# EAGLE schematic board (EAGLE 9.6.2)

## Sheet 1 of 2
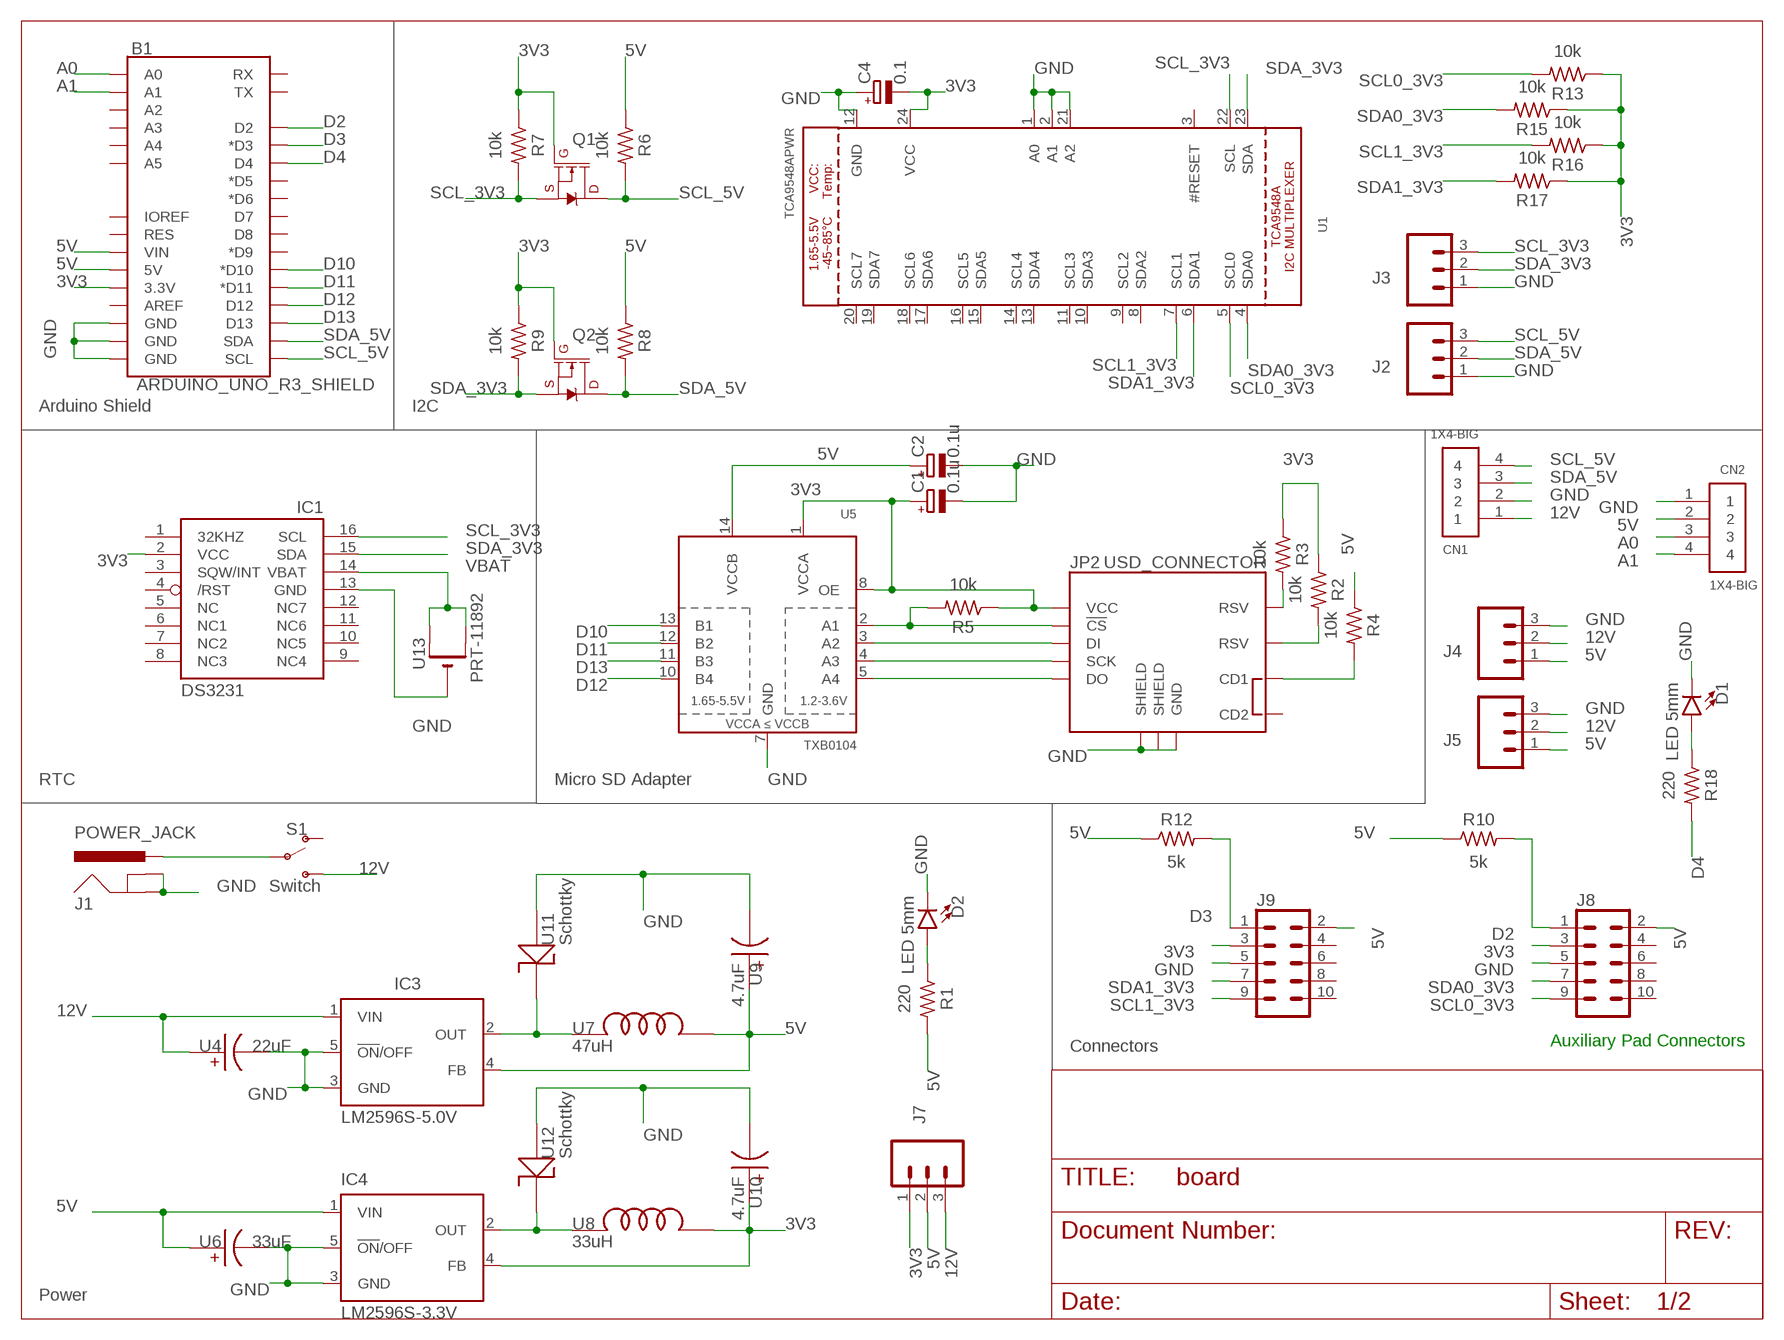
[diagram p0: schematic, sheet 1]

### Parts
B1  ARDUINO_UNO_R3_SHIELD  ARDUINO_UNO_R3_SHIELDUNO_R3_SHIELD_NOLABELS_LOCK  [UNO_R3_SHIELD_NOLABELS_LOCK]
C1  0.1u  C-POL_TANTALUM-1206(3216-METRIC)  [CAPMP3216X180N]
C2  0.1u  C-POL_TANTALUM-1206(3216-METRIC)  [CAPMP3216X180N]
C4  0.1  C-POL_TANTALUM-1206(3216-METRIC)  [CAPMP3216X180N]
CN1  1X4-BIG  [1X04-BIG]
CN2  1X4-BIG  [1X04-BIG]
D1  LED 5mm  LED5MM  [LED_5MM]
D2  LED 5mm  LED5MM  [LED_5MM]
IC1  DS3231/SO  [SO16W]
IC3  LM2596S-5.0V  LM2596S  [TO263-5]
IC4  LM2596S-3.3V  LM2596S  [TO263-5]
J1  POWER_JACK  [POWER_JACK_PTH]
J2  3-Pin Screw Terminal 5mm  CONN_03-SCREW-5MM  [SCREWTERMINAL-5MM-3]
J3  3-Pin Screw Terminal 5mm  CONN_03-SCREW-5MM  [SCREWTERMINAL-5MM-3]
J4  3-Pin Screw Terminal 5mm  CONN_03-SCREW-5MM  [SCREWTERMINAL-5MM-3]
J5  3-Pin Screw Terminal 5mm  CONN_03-SCREW-5MM  [SCREWTERMINAL-5MM-3]
J7  3-Pin Screw Terminal 5mm  CONN_03-SCREW-5MM  [SCREWTERMINAL-5MM-3]
J8  2x6 0.1" Shrouded Female Header  CONN_05X2SHD_LOCK  [2X5-SHROUDED_LOCK]
J9  2x6 0.1" Shrouded Female Header  CONN_05X2SHD_LOCK  [2X5-SHROUDED_LOCK]
JP2  USD_CONNECTOR  [MICRO-SD-SOCKET-PP]
Q1  220mA/50V/3.5Ω  MOSFET-NCH-BSS138  [SOT23-3]
Q2  220mA/50V/3.5Ω  MOSFET-NCH-BSS138  [SOT23-3]
R1  220  R-US_CHIP-0603(1608-METRIC)  [RESC1608X60]
R2  10k  R-US_CHIP-0603(1608-METRIC)  [RESC1608X60]
R3  10k  R-US_CHIP-0603(1608-METRIC)  [RESC1608X60]
R4  10k  R-US_CHIP-0603(1608-METRIC)  [RESC1608X60]
R5  10k  R-US_CHIP-0603(1608-METRIC)  [RESC1608X60]
R6  10k  R-US_CHIP-0603(1608-METRIC)  [RESC1608X60]
R7  10k  R-US_CHIP-0603(1608-METRIC)  [RESC1608X60]
R8  10k  R-US_CHIP-0603(1608-METRIC)  [RESC1608X60]
R9  10k  R-US_CHIP-0603(1608-METRIC)  [RESC1608X60]
R10  5k  R-US_CHIP-0603(1608-METRIC)  [RESC1608X60]
R12  5k  R-US_CHIP-0603(1608-METRIC)  [RESC1608X60]
R13  10k  R-US_CHIP-0603(1608-METRIC)  [RESC1608X60]
R15  10k  R-US_CHIP-0603(1608-METRIC)  [RESC1608X60]
R16  10k  R-US_CHIP-0603(1608-METRIC)  [RESC1608X60]
R17  10k  R-US_CHIP-0603(1608-METRIC)  [RESC1608X60]
R18  220  R-US_CHIP-0603(1608-METRIC)  [RESC1608X60]
S1  Switch  SWITCH-SPDT-PTH-11.6X4.0MM  [SWITCH_SPDT_PTH_11.6X4.0MM]
U1  TCA9548APWR  TCA9548A  [TSSOP24]
U4  22uF  CAP_ALUM_22UF_20%_63V_SMD  [CAP_ALUM_22UF_20%_63V_SMD]
U5  TXB0104  TXB0104PWRSOIC14  [SO14]
U6  33uF  CAP_ALUM_33UF_20%_63V_SMD  [CAP_ALUM_33UF_20%_63V_SMD]
U7  47uH  FIXED_IND_47UH_3.8A_60_MOHM_SMD  [FIXED_IND_47UH_3.8A_60_MOHM_SMD]
U8  33uH  FIXED_IND_47UH_3.8A_60_MOHM_SMD  [FIXED_IND_47UH_3.8A_60_MOHM_SMD]
U9  4.7uF  CAP_ALUM_4.7_UF_20%_100V_SMD  [CAP_ALUM_4.7UF_20%_100V_SMD]
U10  4.7uF  CAP_ALUM_4.7_UF_20%_100V_SMD  [CAP_ALUM_4.7UF_20%_100V_SMD]
U11  Schottky  DIODE_SCHOTTKY_40V_3A_SMC  [DIODE_SCHOTTKY_40V_3A_SMC]
U12  Schottky  DIODE_SCHOTTKY_40V_3A_SMC  [DIODE_SCHOTTKY_40V_3A_SMC]
U13  PRT-11892  CR2032SMT  [CR2032-SMD]

### Nets
3V3 [power]: B1.3.3V C1.1(+) C4.2(-) IC1.2(VCC) IC4.4(FB) J7.1 J8.3 J9.3 JP2.VCC Q1.1(G) Q2.1(G) R2.1 R3.1 R5.1 R7.1 R9.1 R13.1 R15.1 R16.1 R17.1 U1.24(VCC) U5.1(VCCA) U5.8(OE) U8.P$2 U10.P$2
5V [power]: B1.5V B1.VIN C2.1(+) CN2.2 IC3.4(FB) IC4.1(VIN) J4.1 J5.1 J7.2 J8.2 J9.2 R1.2 R4.1 R6.1 R8.1 R10.1 R12.1 U5.14(VCCB) U6.P$2 U7.P$2 U9.P$2
12V [power]: CN1.1 IC3.1(VIN) J4.2 J5.2 J7.3 S1.3(S) U4.P$2
!CS_3V3: JP2.CS(!CS) R5.2 U5.2(A1)
A0: B1.A0 CN2.3
A1: B1.A1 CN2.4
CDSDSD: JP2.CD1 R4.2
D2: B1.D2 J8.1 R10.2
D3: B1.D3(*D3) J9.1 R12.2
D4: B1.D4 R18.2
D10: B1.D10(*D10) U5.13(B1)
D11: B1.D11(*D11) U5.12(B2)
D12: B1.D12 U5.10(B4)
D13: B1.D13 U5.11(B3)
DI_3V3: JP2.DI U5.3(A2)
DO_3V3: JP2.DO U5.5(A4)
GND [power]: B1.GND@0(GND) B1.GND@1(GND) B1.GND@2(GND) C1.2(-) C2.2(-) C4.1(+) CN1.2 CN2.1 D1.K(C) D2.K(C) IC1.13(GND) IC3.3(GND) IC3.5(!ON!/OFF) IC4.3(GND) IC4.5(!ON!/OFF) J1.GND J1.GNDBREAK J2.1 J3.1 J4.3 J5.3 J8.5 J9.5 JP2.GND JP2.GND1(SHIELD) JP2.GND3(SHIELD) U1.1(A0) U1.2(A1) U1.12(GND) U1.21(A2) U4.P$1 U5.7(GND) U6.P$1 U9.P$1 U10.P$1 U11.P$1 U12.P$1 U13.-
N$1: D1.A R18.1
N$2: JP2.RSV1(RSV) R3.2
N$3: JP2.RSV2(RSV) R2.2
N$5: D2.A R1.1
N$7: IC3.2(OUT) U7.P$1 U11.P$2
N$10: IC4.2(OUT) U8.P$1 U12.P$2
PWR_IN [power]: J1.PWR S1.2(P)
SCK_3V3: JP2.SCLK(SCK) U5.4(A3)
SCL0_3V3: J8.9 R13.2 U1.5(SCL0)
SCL1_3V3: J9.9 R16.2 U1.7(SCL1)
SCL_3V3: IC1.16(SCL) J3.3 Q1.2(S) R7.2 U1.22(SCL)
SCL_5V: B1.SCL CN1.4 J2.3 Q1.3(D) R6.2
SDA0_3V3: J8.7 R15.2 U1.4(SDA0)
SDA1_3V3: J9.7 R17.2 U1.6(SDA1)
SDA_3V3: IC1.15(SDA) J3.2 Q2.2(S) R9.2 U1.23(SDA)
SDA_5V: B1.SDA CN1.3 J2.2 Q2.3(D) R8.2
VBAT: IC1.14(VBAT) U13.+$1(+) U13.+$2(+1)
Unconnected: B1.A2 B1.A3 B1.A4 B1.A5 B1.AREF B1.D5(*D5) B1.D6(*D6) B1.D7 B1.D8 B1.D9(*D9) B1.IOREF B1.RES B1.RX B1.TX IC1.1(32KHZ) IC1.3(SQW/INT) IC1.4(/RST) IC1.5(NC) IC1.6(NC1) IC1.7(NC2) IC1.8(NC3) IC1.9(NC4) IC1.10(NC5) IC1.11(NC6) IC1.12(NC7) J8.4 J8.6 J8.8 J8.10 J9.4 J9.6 J9.8 J9.10 JP2.CD2 S1.1(O) U1.3(#RESET) U1.8(SDA2) U1.9(SCL2) U1.10(SDA3) U1.11(SCL3) U1.13(SDA4) U1.14(SCL4) U1.15(SDA5) U1.16(SCL5) U1.17(SDA6) U1.18(SCL6) U1.19(SDA7) U1.20(SCL7)

### Notes on the sheet
- Arduino Shield | I2C
- RTC | Micro SD Adapter
- Auxiliary Pad Connectors
- Connectors
- Power

## Sheet 2 of 2
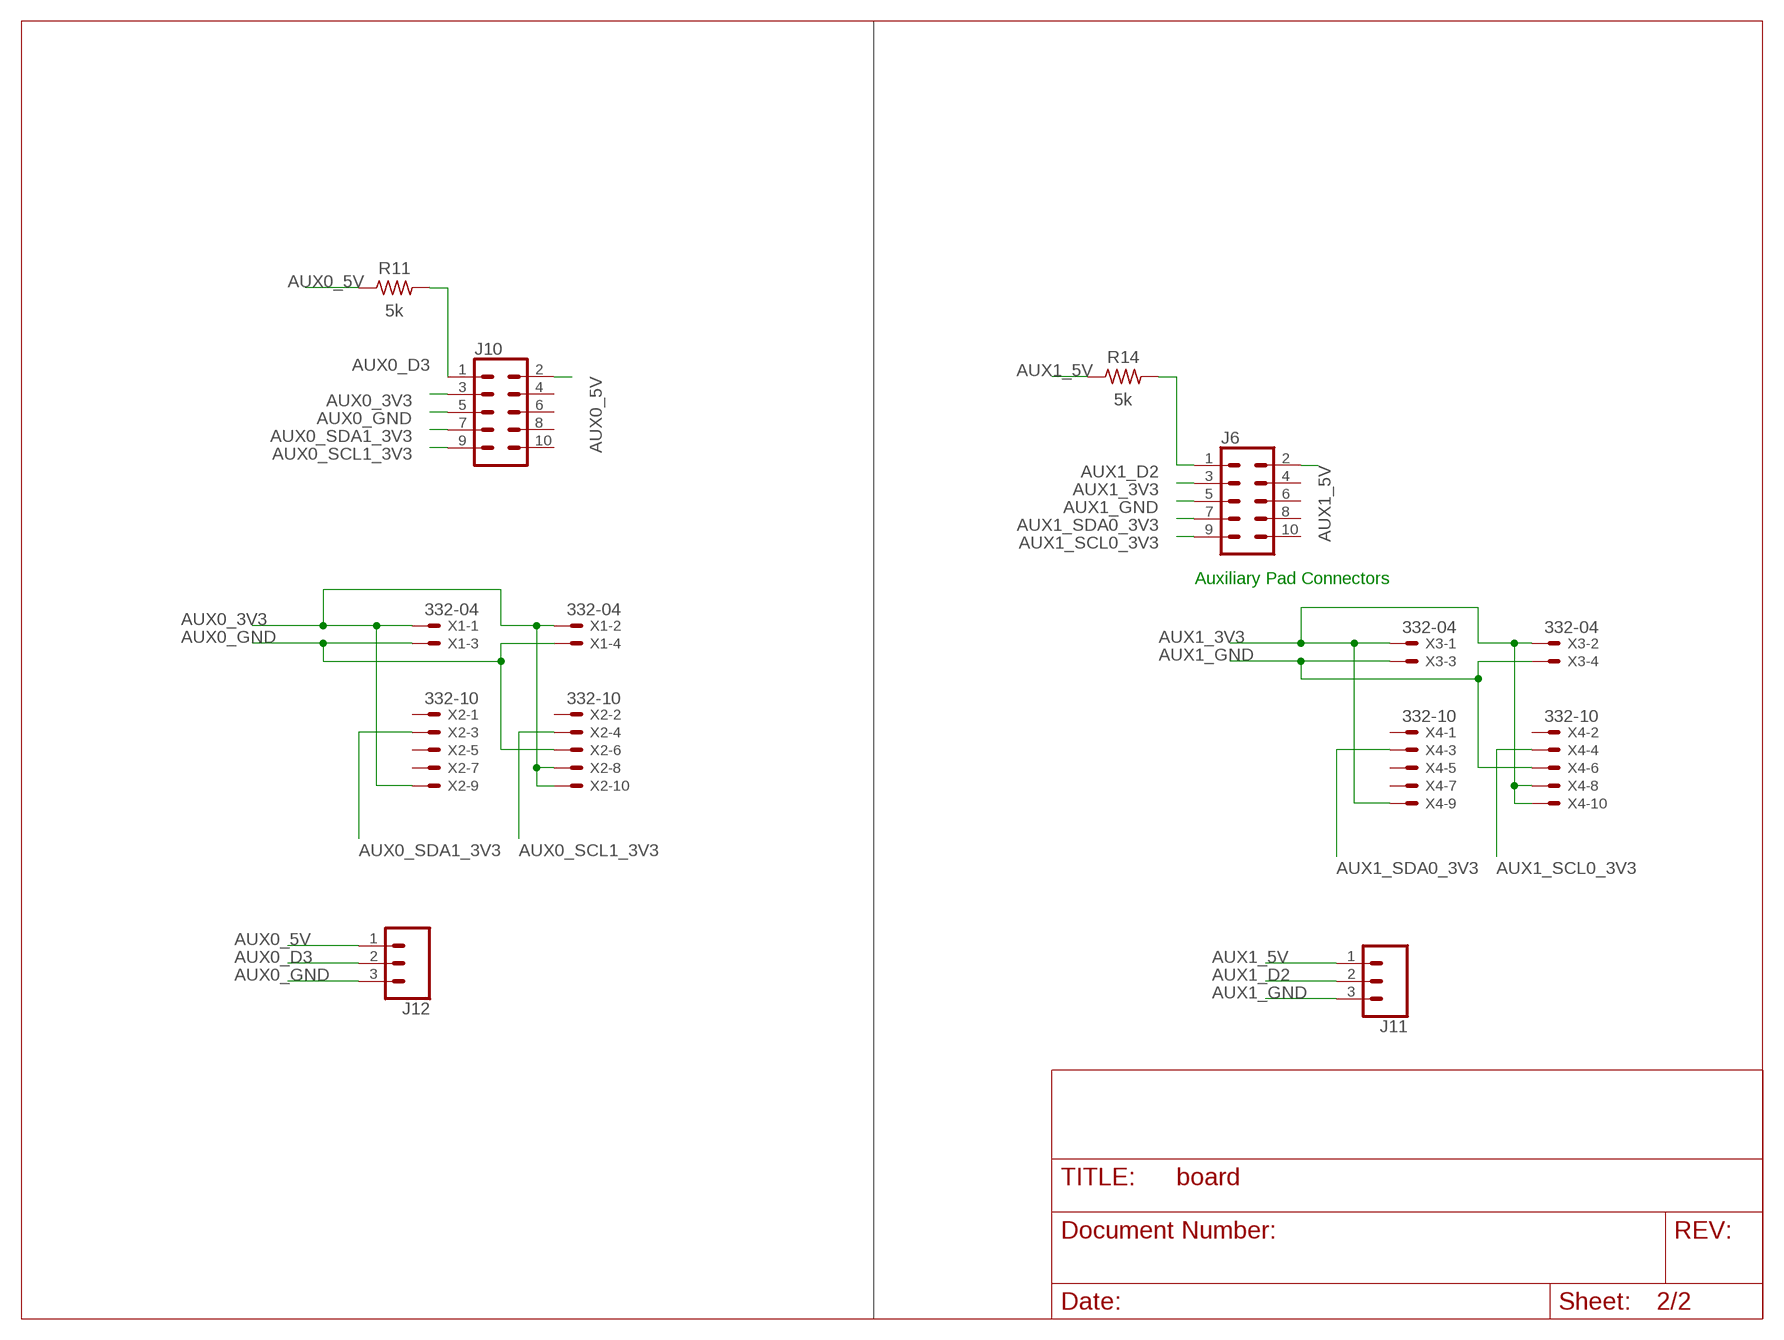
[diagram p1: schematic, sheet 2]

### Parts
J6  2x6 0.1" Shrouded Female Header  CONN_05X2SHD_LOCK  [2X5-SHROUDED_LOCK]
J10  2x6 0.1" Shrouded Female Header  CONN_05X2SHD_LOCK  [2X5-SHROUDED_LOCK]
J11  CONN_03  [1X03]
J12  CONN_03  [1X03]
R11  5k  R-US_CHIP-0603(1608-METRIC)  [RESC1608X60]
R14  5k  R-US_CHIP-0603(1608-METRIC)  [RESC1608X60]
X1  332-04  [332-04]
X2  332-10  [332-10]
X3  332-04  [332-04]
X4  332-10  [332-10]

### Nets
AUX0_3V3 [power]: J10.3 X1.1 X1.2 X2.8 X2.9 X2.10
AUX0_5V [power]: J10.2 J12.1 R11.1
AUX0_D3: J10.1 J12.2 R11.2
AUX0_GND [power]: J10.5 J12.3 X1.3 X1.4 X2.6
AUX0_SCL1_3V3: J10.9 X2.4
AUX0_SDA1_3V3: J10.7 X2.3
AUX1_3V3 [power]: J6.3 X3.1 X3.2 X4.8 X4.9 X4.10
AUX1_5V [power]: J6.2 J11.1 R14.1
AUX1_D2: J6.1 J11.2 R14.2
AUX1_GND [power]: J6.5 J11.3 X3.3 X3.4 X4.6
AUX1_SCL0_3V3: J6.9 X4.4
AUX1_SDA0_3V3: J6.7 X4.3
Unconnected: J6.4 J6.6 J6.8 J6.10 J10.4 J10.6 J10.8 J10.10 X2.1 X2.2 X2.5 X2.7 X4.1 X4.2 X4.5 X4.7

### Notes on the sheet
- Auxiliary Pad Connectors

## Library data of the parts
B1 = SparkFun-Boards:ARDUINO_UNO_R3_SHIELD: Arduino R3 Shield Footprint Shield form compatible with the Arduino Uno R3. SparkFun Products: MG2639 Cellular Shield <https://www.sparkfun.com/products/13120> MIDI Shield <https://www.sparkfun.com/products/12898> R3 Stackable Headers Kit <https://www.sparkfun.com/products/11417>
C1 C2 C4 = Capacitor:C-POL: Capacitor Polarised - Generic; CATEGORY: Capacitor
CN1 CN2 = adafruit:1X4: 4-pin connector
D1 D2 = SparkFun-LED:LED: LED (Generic) Standard schematic elements and footprints for 5mm, 3mm, 1206, and 0603 sized LEDs. Generic LEDs with no color specified.; PARTNO: FLC INVENTORY
IC1 = adafruit:DS3231
IC3 IC4 = national-semiconductor:LM2596: SIMPLE SWITCHER® Power Converter 150 kHz 3A Step-Down Voltage Regulator Source: http://www.national.com/ds/LM/LM2596.pdf; MF: NATIONAL SEMICONDUCTOR; MPN: LM2596S-ADJ/NOPB; OC_FARNELL: 9494367; OC_NEWARK: 41K3842; PARTNO: FLC INVENTORY
J1 = SparkFun-Connectors:POWER_JACK: Power Jack Connector This is the standard 5.5mm barrel jack for power. The PTH is the most common, proven, reliable, footprint. The Slot footprint only works if the mill layer is transmitted to the PCB fab house so be warned. Here are the connectors we sell at SparkFun: DC Barrel Power Jack/Connector <https://www.sparkfun.com/products/119> (PRT-00119) DC Barrel Power Jack/Connector (SMD) <https://www.sparkfun.com/products/12748> (PRT-12748) DC Barrel Jack Adapter - Breadboard Compatible <https://www.sparkfun.com/products/10811> (PRT-10811) It is used on this SparkFun product (and many, many others): SparkFun RedBoard - Programmed with Arduino <https://www.sparkfun.com/products/12757> (DEV-12757) Also, if you need a mating power supply or connector, please check these out: Wall Adapter Power Supply - 9VDC 650mA <https://www.sparkfun.com/products/298> (TOL-00298) DC Barrel Jack Adapter - Male <https://www.sparkfun.com/products/10287> (PRT-10287); PARTNO: FLC INVENTORY; PROD_ID: CONN-08197
J2-J5 J7 = SparkFun-Connectors:CONN_03: Multi connection point. Often used as Generic Header-pin footprint for 0.1 inch spaced/style header connections On any of the 0.1 inch spaced packages, you can populate with these: Break Away Headers - Straight <https://www.sparkfun.com/products/116> (PRT-00116) Break Away Male Headers - Right Angle <https://www.sparkfun.com/products/553> (PRT-00553) Female Headers <https://www.sparkfun.com/products/115> (PRT-00115) Break Away Headers - Machine Pin <https://www.sparkfun.com/products/117> (PRT-00117) Break Away Female Headers - Swiss Machine Pin <https://www.sparkfun.com/products/743> (PRT-00743) Stackable Header - 3 Pin (Female, 0.1") <https://www.sparkfun.com/products/13875> (PRT-13875) For SCREWTERMINALS and SPRING TERMINALS visit here: Screw Terimnals on SparkFun.com <https://www.sparkfun.com/search/results?term=Screw+Terminals> (5mm/3.5mm/2.54mm spacing) This device is also useful as a general connection point to wire up your design to another part of your project. Our various solder wires solder well into these plated through hole pads. Hook-Up Wire - Assortment (Stranded, 22 AWG) <https://www.sparkfun.com/products/11375> (PRT-11375) Hook-Up Wire - Assortment (Solid Core, 22 AWG) <https://www.sparkfun.com/products/11367> (PRT-11367) View the entire wire category on our website here <https://www.sparkfun.com/categories/141> Special notes: Molex polarized connector foot print use with SKU : PRT-08232 with associated crimp pins and housings.; PARTNO: 2057-EB21A-03-C-ND; PROD_ID: CONN-10134; SF_SKU: PRT-08433
J6 J8-J10 = SparkFun-Connectors:CONN_05X2: Multi connection point. Often used as Generic Header-pin footprint for 0.1 inch spaced/style header connections For AVR SPI programming port, see special device with nice symbol: "AVR_SPI_PROG_5x2.dev" You can populate with any combo of single row headers, but if you'd like an exact match, check these: 2x5 AVR ICSP Male Header <https://www.sparkfun.com/products/778> (PRT-00778) 2x5 Pin Shrouded Header <https://www.sparkfun.com/products/8506> (PRT-08506) On any of the 0.1 inch spaced packages, you can populate with these: Break Away Headers - Straight <https://www.sparkfun.com/products/116> (PRT-00116) Break Away Male Headers - Right Angle <https://www.sparkfun.com/products/553> (PRT-00553) Female Headers <https://www.sparkfun.com/products/115> (PRT-00115) Break Away Headers - Machine Pin <https://www.sparkfun.com/products/117> (PRT-00117) Break Away Female Headers - Swiss Machine Pin <https://www.sparkfun.com/products/743> (PRT-00743) Special note: the shrouded connector mates well with our 5x2 ribbon cables: 2x5 Pin IDC Ribbon Cable <https://www.sparkfun.com/products/8535> (PRT-08535); PARTNO: PRT-08506 and PRT-10650; PROD_ID: CONN-08671; SF_ID: PRT-08506
J11 J12 = SparkFun-Connectors:CONN_03: Multi connection point. Often used as Generic Header-pin footprint for 0.1 inch spaced/style header connections On any of the 0.1 inch spaced packages, you can populate with these: Break Away Headers - Straight <https://www.sparkfun.com/products/116> (PRT-00116) Break Away Male Headers - Right Angle <https://www.sparkfun.com/products/553> (PRT-00553) Female Headers <https://www.sparkfun.com/products/115> (PRT-00115) Break Away Headers - Machine Pin <https://www.sparkfun.com/products/117> (PRT-00117) Break Away Female Headers - Swiss Machine Pin <https://www.sparkfun.com/products/743> (PRT-00743) Stackable Header - 3 Pin (Female, 0.1") <https://www.sparkfun.com/products/13875> (PRT-13875) For SCREWTERMINALS and SPRING TERMINALS visit here: Screw Terimnals on SparkFun.com <https://www.sparkfun.com/search/results?term=Screw+Terminals> (5mm/3.5mm/2.54mm spacing) This device is also useful as a general connection point to wire up your design to another part of your project. Our various solder wires solder well into these plated through hole pads. Hook-Up Wire - Assortment (Stranded, 22 AWG) <https://www.sparkfun.com/products/11375> (PRT-11375) Hook-Up Wire - Assortment (Solid Core, 22 AWG) <https://www.sparkfun.com/products/11367> (PRT-11367) View the entire wire category on our website here <https://www.sparkfun.com/categories/141> Special notes: Molex polarized connector foot print use with SKU : PRT-08232 with associated crimp pins and housings.
JP2 = SparkFun-Connectors:USD_CONNECTOR: microSD Socket Push-push type µSD socket. Footprint production proven. Symbol has new and improved layout and naming accuracy. SparkFun Electronics SKU : PRT-00127. tDoc lines correctly indicate media card edge positions when inserting (unlocked, locked, depressed). NOTE: CD1 and CD2 are connected internally; PROD_ID: CONN-07820
Q1 Q2 = SparkFun-DiscreteSemi:MOSFET-NCH: N-channel MOSFETs Voltage controlled devices that allow control of high current outputs. SparkFun Products: SparkFun OpenScale <https://www.sparkfun.com/products/13261> SparkFun Digital Sandbox <https://www.sparkfun.com/products/12651> SparkFun Monster Moto Shield <https://www.sparkfun.com/products/10182> SparkFun MOSFET Power Controller <https://www.sparkfun.com/products/11214>; PROD_ID: TRANS-00830
R1-R18 = Resistor:R-US: Resistor Fixed - ANSI; CATEGORY: Resistor; SUB-CATEGORY: Fixed
S1 = SparkFun-Switches:SWITCH-SPDT: Single Pole, Double Throw (SPDT) Switch Single-pole, double-throw (SPDT) switch. Variant Overview SMD-AYZ0202 Surface Mount DPDT Switch <https://www.sparkfun.com/products/597> (COM-00597) Used on e.g. LilyPad Arduino USB - ATmega32U4 Board <https://www.sparkfun.com/products/12049> PTH-11.6X4.0MM SPDT Mini Power Switch <https://www.sparkfun.com/products/102> (COM-00102) Used on e.g. SparkFun Simon Says - Through-Hole Soldering Kit <https://www.sparkfun.com/products/10547> (KIT-10547) PTH-11.6X4.0MM-KIT KIT version of SPDT Mini Power Switch - Simplifies soldering by removing tStop of switch pins - only one side can be soldered. PTH-11.6X4.0MM-LOCK LOCK version of SPDT Mini Power Switch - Offset pins hold switch in place for easier soldering. SMD-RIGHT-ANGLE Surface Mount Right Angle Switch <https://www.sparkfun.com/products/10860> (COM-10860) Used on e.g. SparkFun ESP8266 Thing <https://www.sparkfun.com/products/13231>; PARTNO: EG2355-ND; PROD_ID: SWCH-08261; SF_SKU: COM-00102
U1 = microbuilder:TCA9548A: TCA9548A I2C Multiplexer
U4 = vreg_5v_33v:CAP_ALUM_22UF_20%_63V_SMD; PARTNO: FLC INVENTORY
U5 = SparkFun-DigitalIC:TXB0104PWR: 4-Bit Bi-Directional Level Shifter 1.2V-3.6V (VCCA) to 1.65V-5.5V (VCCB) bi-directional level shifter with auto direction sensing. Max data rate - VCCA 1.8V: 20Mbps (50ns), VCCA 3.3V: 100Mbps (10ns) Digikey: 296-21929-1-ND (TSSOP) IC-11329; PROD_ID: IC-11329
U6 = vreg_5v_33v:CAP_ALUM_33UF_20%_63V_SMD; PARTNO: FLC INVENTORY
U7 U8 = vreg_5v_33v:FIXED_IND_47UH_3.8A_60_MOHM_SMD; PARTNO: FLC INVENTORY
U9 U10 = vreg_5v_33v:CAP_ALUM_4.7_UF_20%_100V_SMD; PARTNO: FLC INVENTORY
U11 U12 = vreg_5v_33v:DIODE_SCHOTTKY_40V_3A_SMC; PARTNO: FLC INVENTORY
U13 = adafruit:CR2032
X1 X3 = con-garry:332-04: 4 Pin - 2mm Dual Row Source: www.mpe-connector.de / garry_shortform_2012.pdf
X2 X4 = con-garry:332-10: 10 Pin - 2mm Dual Row Source: www.mpe-connector.de / garry_shortform_2012.pdf

## Net classes
0 default: width 0.254 mm, clearance 0.152 mm
1 power: width 0.381 mm, clearance 0.152 mm